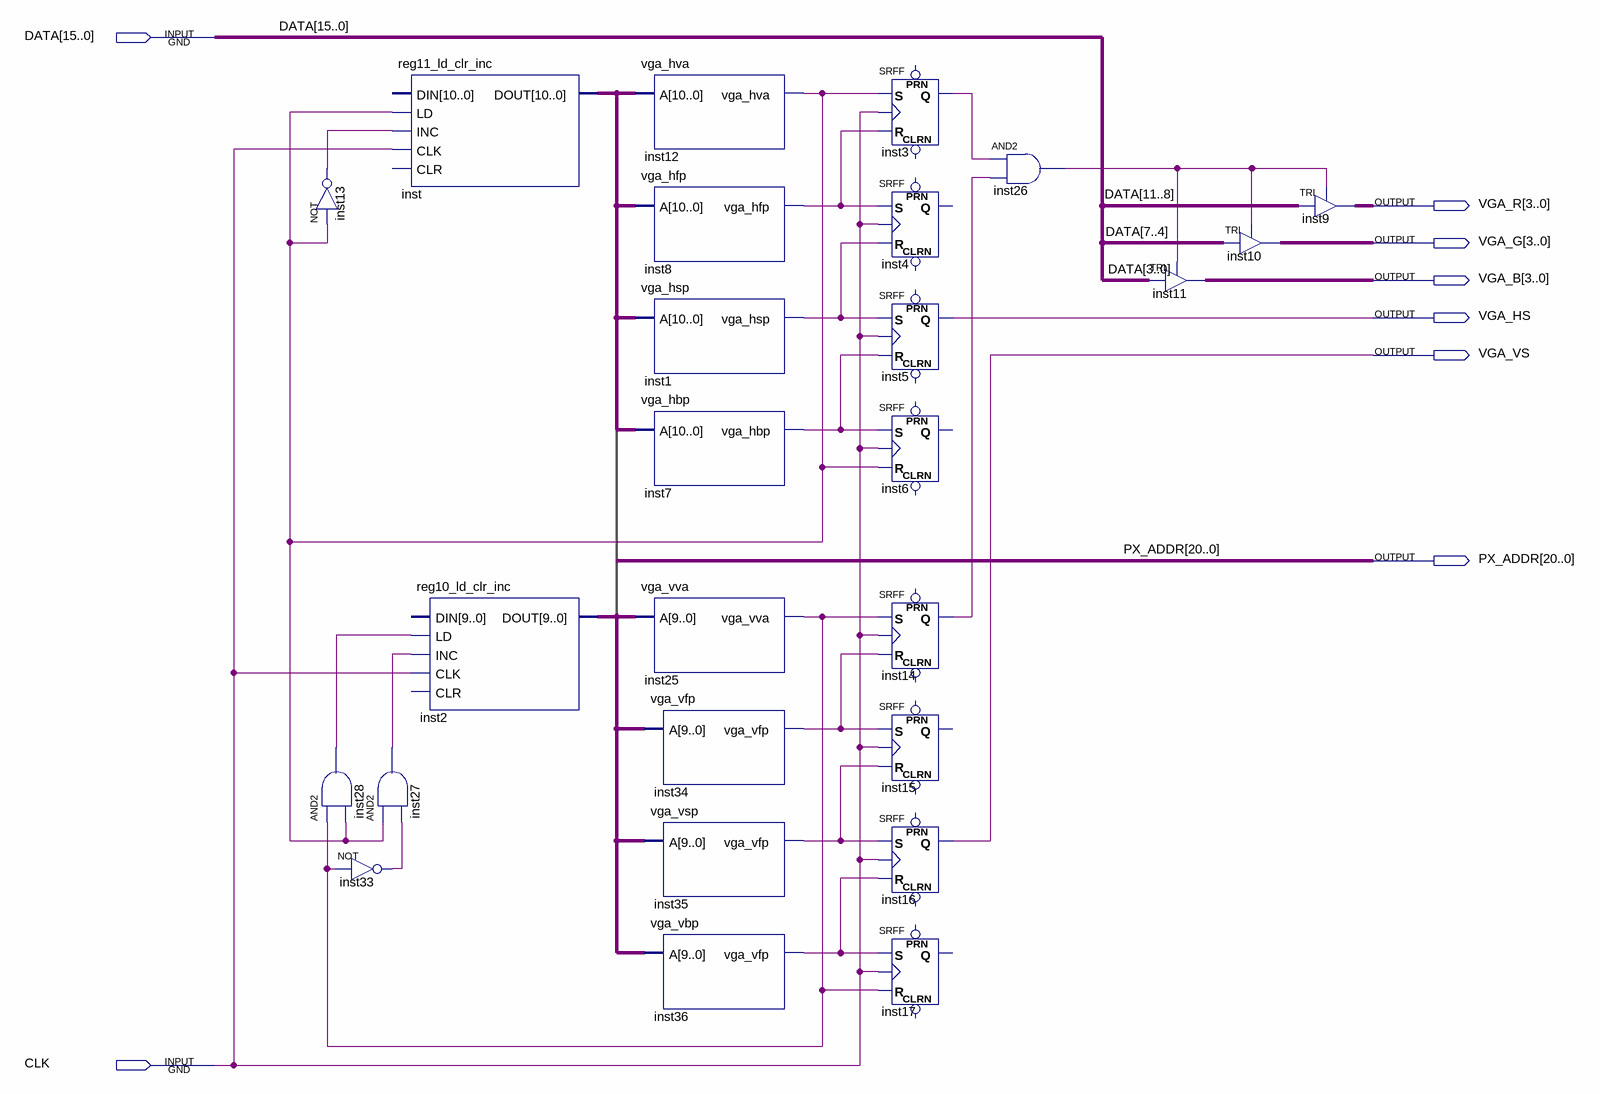
[diagram p0: schematic sheet]
// Quartus schematic dif.bdf as structural Verilog: 26 symbols, 8 pins
module dif (
  input  [15:0] DATA,
  input  CLK,
  output [3:0] VGA_R,
  output [3:0] VGA_G,
  output [3:0] VGA_B,
  output VGA_HS,
  output VGA_VS,
  output [20:0] PX_ADDR
);

  wire inst1_vga_hsp, inst3_q, inst7_vga_hbp, inst8_vga_hfp, inst12_vga_hva, inst13_out, inst14_q,
       inst25_vga_vva, inst26_out, inst27_out, inst28_out, inst33_out, inst34_vga_vfp, inst35_vga_vfp,
       inst36_vga_vfp;

  not inst13 (inst13_out, inst12_vga_hva);
  and inst27 (inst27_out, inst12_vga_hva, inst33_out);
  and inst28 (inst28_out, inst25_vga_vva, inst12_vga_hva);
  not inst33 (inst33_out, inst25_vga_vva);
  reg11_ld_clr_inc inst (.LD(inst12_vga_hva), .INC(inst13_out), .CLK(CLK), .DOUT(PX_ADDR[10:0]));  // open: DIN, CLR
  reg10_ld_clr_inc inst2 (.LD(inst28_out), .INC(inst27_out), .CLK(CLK), .DOUT(PX_ADDR[20:11]));  // open: DIN, CLR
  vga_hva inst12 (.A(PX_ADDR[10:0]), .vga_hva(inst12_vga_hva));
  vga_hfp inst8 (.A(PX_ADDR[10:0]), .vga_hfp(inst8_vga_hfp));
  vga_hsp inst1 (.A(PX_ADDR[10:0]), .vga_hsp(inst1_vga_hsp));
  vga_hbp inst7 (.A(PX_ADDR[10:0]), .vga_hbp(inst7_vga_hbp));
  vga_vva inst25 (.A(PX_ADDR[20:11]), .vga_vva(inst25_vga_vva));
  vga_vfp inst34 (.A(PX_ADDR[20:11]), .vga_vfp(inst34_vga_vfp));
  vga_vsp inst35 (.A(PX_ADDR[20:11]), .vga_vfp(inst35_vga_vfp));
  vga_vbp inst36 (.A(PX_ADDR[20:11]), .vga_vfp(inst36_vga_vfp));
  SRFF inst3 (.S(inst12_vga_hva), .R(inst8_vga_hfp), .CLK(CLK), .Q(inst3_q));  // open: PRN, CLRN
  SRFF inst4 (.S(inst8_vga_hfp), .R(inst1_vga_hsp), .CLK(CLK));  // open: PRN, CLRN, Q
  SRFF inst5 (.S(inst1_vga_hsp), .R(inst7_vga_hbp), .CLK(CLK), .Q(VGA_HS));  // open: PRN, CLRN
  SRFF inst6 (.S(inst7_vga_hbp), .R(inst12_vga_hva), .CLK(CLK));  // open: PRN, CLRN, Q
  SRFF inst14 (.S(inst25_vga_vva), .R(inst34_vga_vfp), .CLK(CLK), .Q(inst14_q));  // open: PRN, CLRN
  SRFF inst15 (.S(inst34_vga_vfp), .R(inst35_vga_vfp), .CLK(CLK));  // open: PRN, CLRN, Q
  SRFF inst16 (.S(inst35_vga_vfp), .R(inst36_vga_vfp), .CLK(CLK), .Q(VGA_VS));  // open: PRN, CLRN
  SRFF inst17 (.S(inst36_vga_vfp), .R(inst25_vga_vva), .CLK(CLK));  // open: PRN, CLRN, Q
  and inst26 (inst26_out, inst3_q, inst14_q);
  TRI inst11[3:0] (.IN(DATA[3:0]), .OE(inst26_out), .OUT(VGA_B));
  TRI inst10[3:0] (.IN(DATA[7:4]), .OE(inst26_out), .OUT(VGA_G));
  TRI inst9[3:0] (.IN(DATA[11:8]), .OE(inst26_out), .OUT(VGA_R));
endmodule
